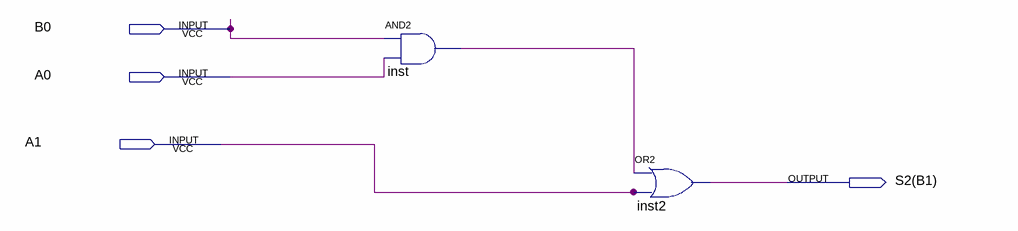
[diagram p0: schematic sheet]
// Quartus schematic Lab4.bdf as structural Verilog: 2 symbols, 4 pins
module Lab4 (
  input  B0,
  input  A0,
  input  A1,
  output \S2(B1) 
);

  wire inst_out;

  and inst (inst_out, B0, A0);
  or inst2 (\S2(B1) , inst_out, A1);
endmodule
